# EAGLE design SparkySpecialKExpansion (EAGLE 6.5.0)
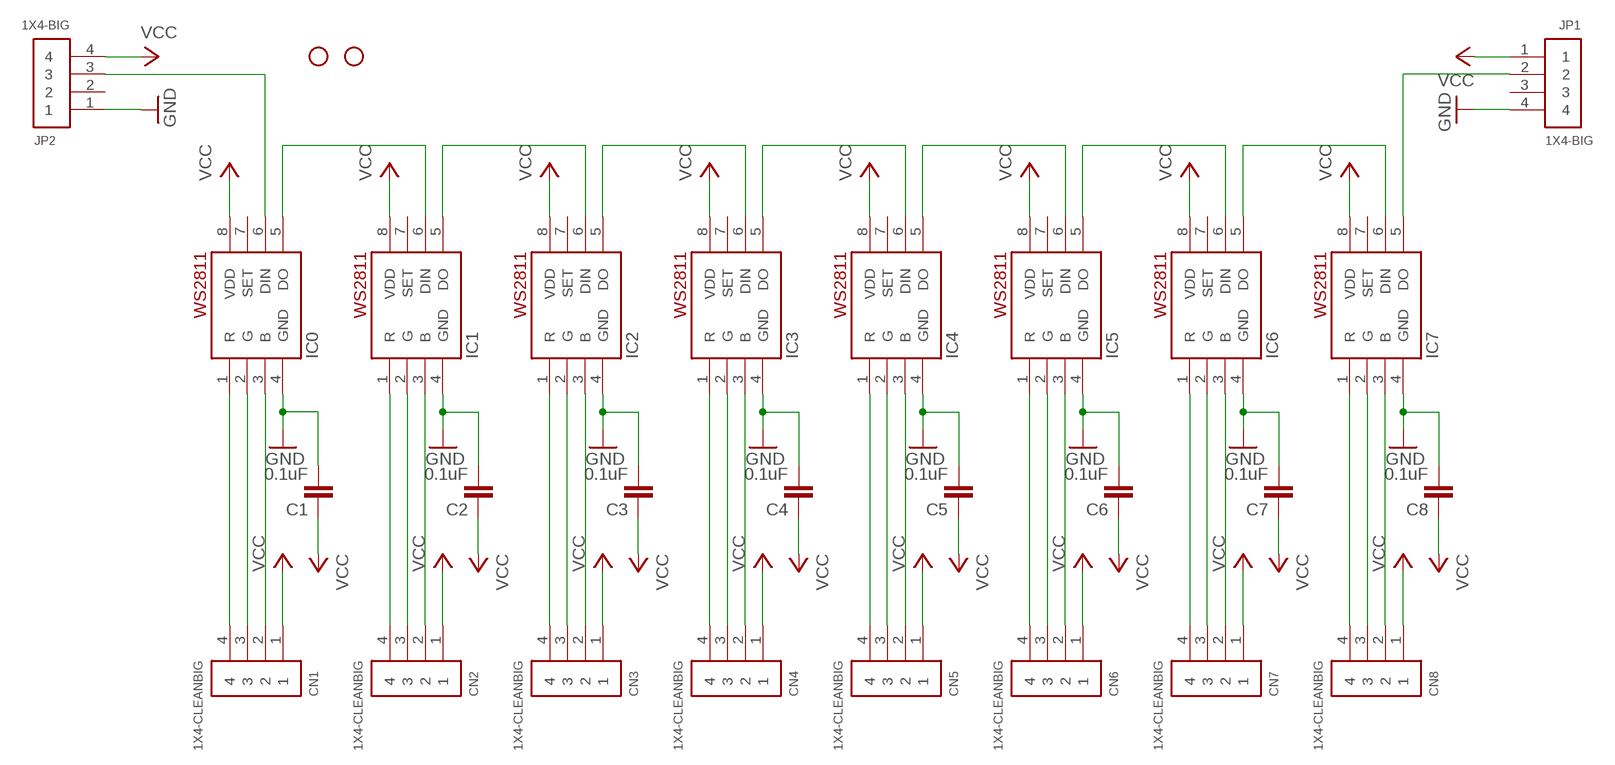
[diagram p0: schematic, sheet 1]

## Parts
C1  0.1uF  CAP0805  [0805]
C2  0.1uF  CAP0805  [0805]
C3  0.1uF  CAP0805  [0805]
C4  0.1uF  CAP0805  [0805]
C5  0.1uF  CAP0805  [0805]
C6  0.1uF  CAP0805  [0805]
C7  0.1uF  CAP0805  [0805]
C8  0.1uF  CAP0805  [0805]
CN1  1X4-CLEANBIG  [1X04-CLEANBIG]
CN2  1X4-CLEANBIG  [1X04-CLEANBIG]
CN3  1X4-CLEANBIG  [1X04-CLEANBIG]
CN4  1X4-CLEANBIG  [1X04-CLEANBIG]
CN5  1X4-CLEANBIG  [1X04-CLEANBIG]
CN6  1X4-CLEANBIG  [1X04-CLEANBIG]
CN7  1X4-CLEANBIG  [1X04-CLEANBIG]
CN8  1X4-CLEANBIG  [1X04-CLEANBIG]
IC0  WS2811-SOP8  [SO08-SKINNYPADS]
IC1  WS2811-SOP8  [SO08-SKINNYPADS]
IC2  WS2811-SOP8  [SO08-SKINNYPADS]
IC3  WS2811-SOP8  [SO08-SKINNYPADS]
IC4  WS2811-SOP8  [SO08-SKINNYPADS]
IC5  WS2811-SOP8  [SO08-SKINNYPADS]
IC6  WS2811-SOP8  [SO08-SKINNYPADS]
IC7  WS2811-SOP8  [SO08-SKINNYPADS]
JP1  1X4-BIG  [1X04-BIG]
JP2  1X4-BIG  [1X04-BIG]
JP3  STAND-OFF  [STAND-OFF]
JP4  STAND-OFF  [STAND-OFF]

## Nets
GND: C1.2 C2.2 C3.2 C4.2 C5.2 C6.2 C7.2 C8.2 IC0.4(GND) IC1.4(GND) IC2.4(GND) IC3.4(GND) IC4.4(GND) IC5.4(GND) IC6.4(GND) IC7.4(GND) JP1.4 JP2.1
N$1: CN1.2 IC0.3(B)
N$2: CN1.3 IC0.2(G)
N$3: CN1.4 IC0.1(R)
N$4: CN2.4 IC1.1(R)
N$5: CN2.3 IC1.2(G)
N$6: CN2.2 IC1.3(B)
N$7: CN3.4 IC2.1(R)
N$8: CN3.3 IC2.2(G)
N$9: CN3.2 IC2.3(B)
N$10: CN4.4 IC3.1(R)
N$11: CN4.3 IC3.2(G)
N$12: CN4.2 IC3.3(B)
N$13: CN5.4 IC4.1(R)
N$14: CN5.3 IC4.2(G)
N$15: CN5.2 IC4.3(B)
N$16: CN6.4 IC5.1(R)
N$17: CN6.3 IC5.2(G)
N$18: CN6.2 IC5.3(B)
N$19: CN7.4 IC6.1(R)
N$20: CN7.3 IC6.2(G)
N$21: CN7.2 IC6.3(B)
N$22: CN8.4 IC7.1(R)
N$23: CN8.3 IC7.2(G)
N$24: CN8.2 IC7.3(B)
N$25: IC0.5(DO) IC1.6(DIN)
N$26: IC1.5(DO) IC2.6(DIN)
N$27: IC2.5(DO) IC3.6(DIN)
N$28: IC3.5(DO) IC4.6(DIN)
N$29: IC4.5(DO) IC5.6(DIN)
N$30: IC5.5(DO) IC6.6(DIN)
N$31: IC6.5(DO) IC7.6(DIN)
N$32: IC7.5(DO) JP1.2
N$33: IC0.6(DIN) JP2.3
VCC: C1.1 C2.1 C3.1 C4.1 C5.1 C6.1 C7.1 C8.1 CN1.1 CN2.1 CN3.1 CN4.1 CN5.1 CN6.1 CN7.1 CN8.1 IC0.8(VDD) IC1.8(VDD) IC2.8(VDD) IC3.8(VDD) IC4.8(VDD) IC5.8(VDD) IC6.8(VDD) IC7.8(VDD) JP1.1 JP2.4
Unconnected: IC0.7(SET) IC1.7(SET) IC2.7(SET) IC3.7(SET) IC4.7(SET) IC5.7(SET) IC6.7(SET) IC7.7(SET) JP1.3 JP2.2

## Library data of the parts
C1-C8 = SparkFun:CAP: Capacitor Standard 0603 ceramic capacitor, and 0.1" leaded capacitor.
CN1-CN8 JP1 JP2 = adafruit:1X4: 4-pin connector
IC0 IC1-IC7 = adafruit:WS2811
JP3 JP4 = SparkFun:STAND-OFF: Stand Off This is the mechanical footprint for a #4 phillips button head screw. Use the keepout ring to avoid running the screw head into surrounding components. SKU : PRT-00447

## Board
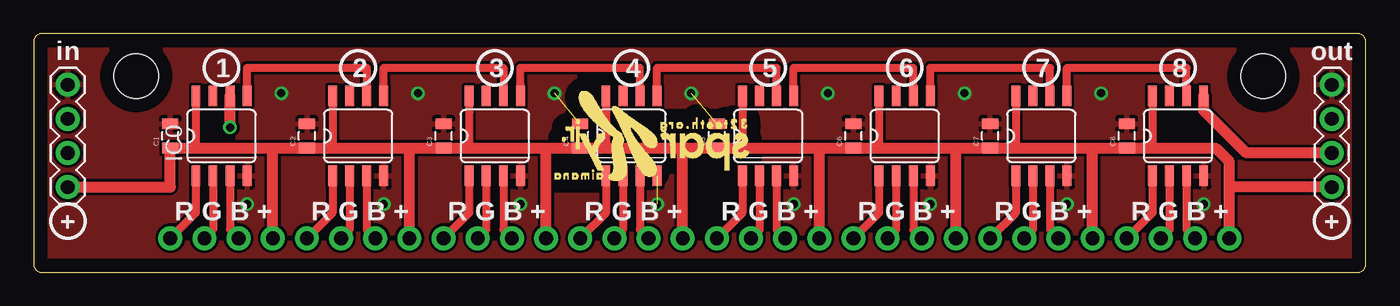
[diagram p1: board, top side]
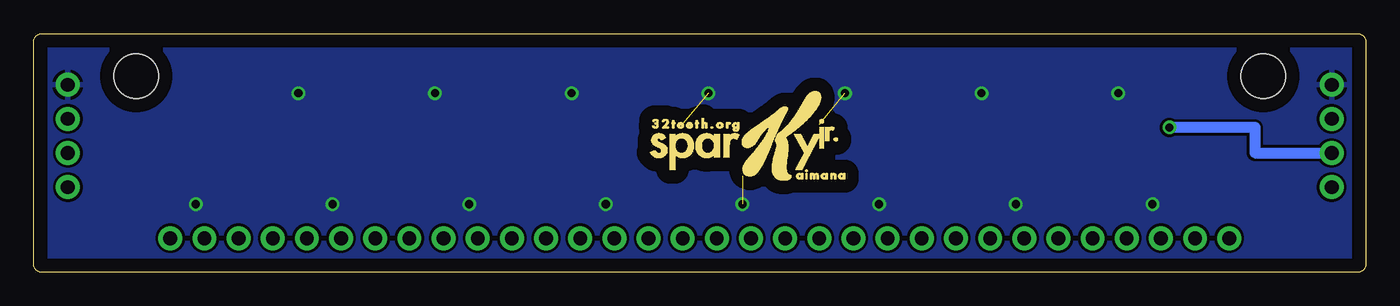
[diagram p2: board, bottom side, seen from below]

Size 99.06 x 17.78 mm. Coordinates in mm from the lower left corner, seen from the top.
Outline: 0.64,0 98.42,0 arc90 99.06,0.64 99.06,17.14 arc90 98.42,17.78 0.64,17.78 arc90 0,17.14 0,0.64 arc90 0.64,0
Copper layers (1*16): Top 0.035mm / dielectric 1.5mm / Bottom 0.035mm
Design rules "default": minimum track width 10mil, minimum drill 24mil, track to track 8mil, track to pad 8mil, pad to pad 8mil, via to via 8mil, smd to smd 8mil, copper to edge 40mil, drill to drill 8mil, minimum pad ring 10mil, minimum via ring 8mil, stop-mask expansion 4mil, vias tented up to drill 0mil, thermal gap 10mil

### Footprints (pad centres in the part's own frame; a part is rotated, then mirrored left to right if it is on the bottom)
0805 = smd 0.8 x 1.2: 1 -0.9,0; 2 0.9,0
1X04-CLEANBIG = drill 1.016 pad 1.778: 1 -3.81,0; 2 -1.27,0; 3 1.27,0; 4 3.81,0
SO08-SKINNYPADS = smd 0.66 x 1.524: 1 -1.905,-2.973; 2 -0.635,-2.973; 3 0.635,-2.973; 4 1.905,-2.973; 5 1.905,2.973; 6 0.635,2.973; 7 -0.635,2.973; 8 -1.905,2.973
1X04-BIG = drill 1.016 pad 1.778: 1 0,0; 2 2.54,0; 3 5.08,0; 4 7.62,0
STAND-OFF = hole 3.302: 0,0

### Placement (x,y rotation side)
C1  10.16,10.16 90 top
C2  20.32,10.16 90 top
C3  30.48,10.16 90 top
C4  40.64,10.16 90 top
C5  50.8,10.16 90 top
C6  60.96,10.16 90 top
C7  71.12,10.16 90 top
C8  81.28,10.16 90 top
CN1  13.97,2.54 180 top
CN2  24.13,2.54 180 top
CN3  34.29,2.54 180 top
CN4  44.45,2.54 180 top
CN5  54.61,2.54 180 top
CN6  64.77,2.54 180 top
CN7  74.93,2.54 180 top
CN8  85.09,2.54 180 top
IC0  13.97,10.16 0 top
IC1  24.13,10.16 0 top
IC2  34.29,10.16 0 top
IC3  44.45,10.16 0 top
IC4  54.61,10.16 0 top
IC5  64.77,10.16 0 top
IC6  74.93,10.16 0 top
IC7  85.09,10.16 0 top
JP1  96.52,6.35 90 top
JP2  2.54,13.97 270 top
JP3  7.62,14.61 0 top
JP4  91.44,14.61 0 top

### Tracks (layer width: path | path; a pad name or v marks a point on that pad's centre or on a via)
GND  (via drill 0.6)  (3 unrouted)
  other vias: 18.41,13.34 28.57,13.34 38.73,13.34 48.9,13.34 59.05,13.34 69.22,13.34 79.38,13.34 15.88,5.08 26.04,5.08 36.2,5.08 46.35,5.08 56.52,5.08 66.67,5.08 76.83,5.08 87,5.08
  pour Top: 0,0 99.06,0 99.06,17.78 0,17.78
  pour Bottom: 0,0 0,17.78 99.06,17.78 99.06,0
N$1
  Top 0.61: IC0.3 14.61,3.18 CN1.2
N$2
  Top 0.61: IC0.2 13.34,3.18 CN1.3
N$3
  Top 0.61: IC0.1 12.06,4.45 CN1.4
N$4
  Top 0.61: IC1.1 22.23,4.45 CN2.4
N$5
  Top 0.61: IC1.2 23.5,3.18 CN2.3
N$6
  Top 0.61: IC1.3 24.77,3.18 CN2.2
N$7
  Top 0.61: IC2.1 32.38,4.45 CN3.4
N$8
  Top 0.61: IC2.2 33.66,3.18 CN3.3
N$9
  Top 0.61: IC2.3 34.92,3.18 CN3.2
N$10
  Top 0.61: IC3.1 42.55,4.45 CN4.4
N$11
  Top 0.61: IC3.2 43.81,3.18 CN4.3
N$12
  Top 0.61: IC3.3 45.09,3.18 CN4.2
N$13
  Top 0.61: IC4.1 52.7,4.45 CN5.4
N$14
  Top 0.61: IC4.2 53.98,3.18 CN5.3
N$15
  Top 0.61: IC4.3 55.24,3.18 CN5.2
N$16
  Top 0.61: IC5.1 62.87,4.45 CN6.4
N$17
  Top 0.61: IC5.2 64.14,3.18 CN6.3
N$18
  Top 0.61: IC5.3 65.41,3.18 CN6.2
N$19
  Top 0.61: IC6.1 73.03,4.45 CN7.4
N$20
  Top 0.61: IC6.2 74.3,3.18 CN7.3
N$21
  Top 0.61: IC6.3 75.56,3.18 CN7.2
N$22
  Top 0.61: IC7.1 83.19,4.45 CN8.4
N$23
  Top 0.61: IC7.2 84.45,3.18 CN8.3
N$24
  Top 0.61: IC7.3 85.72,3.18 CN8.2
N$25
  Top 0.61: IC0.5 15.88,15.24 24.77,15.24 IC1.6
N$26
  Top 0.61: IC1.5 26.04,15.24 34.92,15.24 IC2.6
N$27
  Top 0.61: IC2.5 36.2,15.24 45.09,15.24 IC3.6
N$28
  Top 0.61: IC3.5 46.35,15.24 55.24,15.24 IC4.6
N$29
  Top 0.61: IC4.5 56.52,15.24 65.41,15.24 IC5.6
N$30
  Top 0.61: IC5.5 66.67,15.24 75.56,15.24 IC6.6
N$31
  Top 0.61: IC6.5 76.83,15.24 85.72,15.24 IC7.6
N$32
  Top 0.813: JP1.2 90.17,8.89 87,12.07 IC7.5
N$33  (via drill 0.6)
  Top 0.813: v14.61,10.79 IC0.6
  Bottom 0.813: v14.61,10.79 8.26,10.79 8.26,8.89 JP2.3
VCC
  Top 0.61: IC0.8 12.06,9.26 11.43,9.26 | IC1.8 22.23,9.26 22.86,9.26 | IC2.8 32.38,9.26 33.02,9.26 | IC3.8 42.55,9.26 43.18,9.26 | IC4.8 52.7,9.26 52.07,9.26 | IC5.8 62.87,9.26 62.23,9.26 | IC6.8 73.03,9.26 73.66,9.26 | IC7.8 83.19,9.26 82.55,9.26
  Top 0.813: JP2.4 10.16,6.35 C1.1 11.43,9.26 17.78,9.26 | 17.78,9.26 C2.1 22.86,9.26 27.94,9.26 | 27.94,9.26 C3.1 33.02,9.26 38.1,9.26 | 38.1,9.26 C4.1 43.18,9.26 48.26,9.26 | 48.26,9.26 C5.1 52.07,9.26 58.42,9.26 | 58.42,9.26 C6.1 62.23,9.26 68.58,9.26 | 68.58,9.26 C7.1 73.66,9.26 78.74,9.26 | 78.74,9.26 C8.1 82.55,9.26 87.89,9.26 88.9,8.25 88.9,6.35 | CN1.1 17.78,9.26 | CN2.1 27.94,9.26 | CN3.1 38.1,9.26 | CN4.1 48.26,9.26 | CN5.1 58.42,9.26 | CN6.1 68.58,9.26 | CN7.1 78.74,9.26 | CN8.1 88.9,6.35 | JP1.1 88.9,6.35

### Text on the board
tPlace: in | out | 1 / / / / / R G B + | 2 / / / / / R G B + | 3 / / / / / R G B + | 4 / / / / / R G B + | 5 / / / / / R G B + | 6 / / / / / R G B + | 7 / / / / / R G B + | 8 / / / / / R G B + | + | +